# Altium schematic sheet [1]-multipass.SchDoc: ENTER SHEET TITLE
size B; Engineer: ENTER ENGINEER NAME; Organization: CUAir; Address1: L3, 12a Rodborough Rd; Address2: Frenchs Forest; Address3: NSW; Address4: Australia 2086; Revision: ENTER REVISION NUMBER; CompetitionYear: 2019; CPN: ENTER CPN; PROJECT: ENTER PROJECT NAME
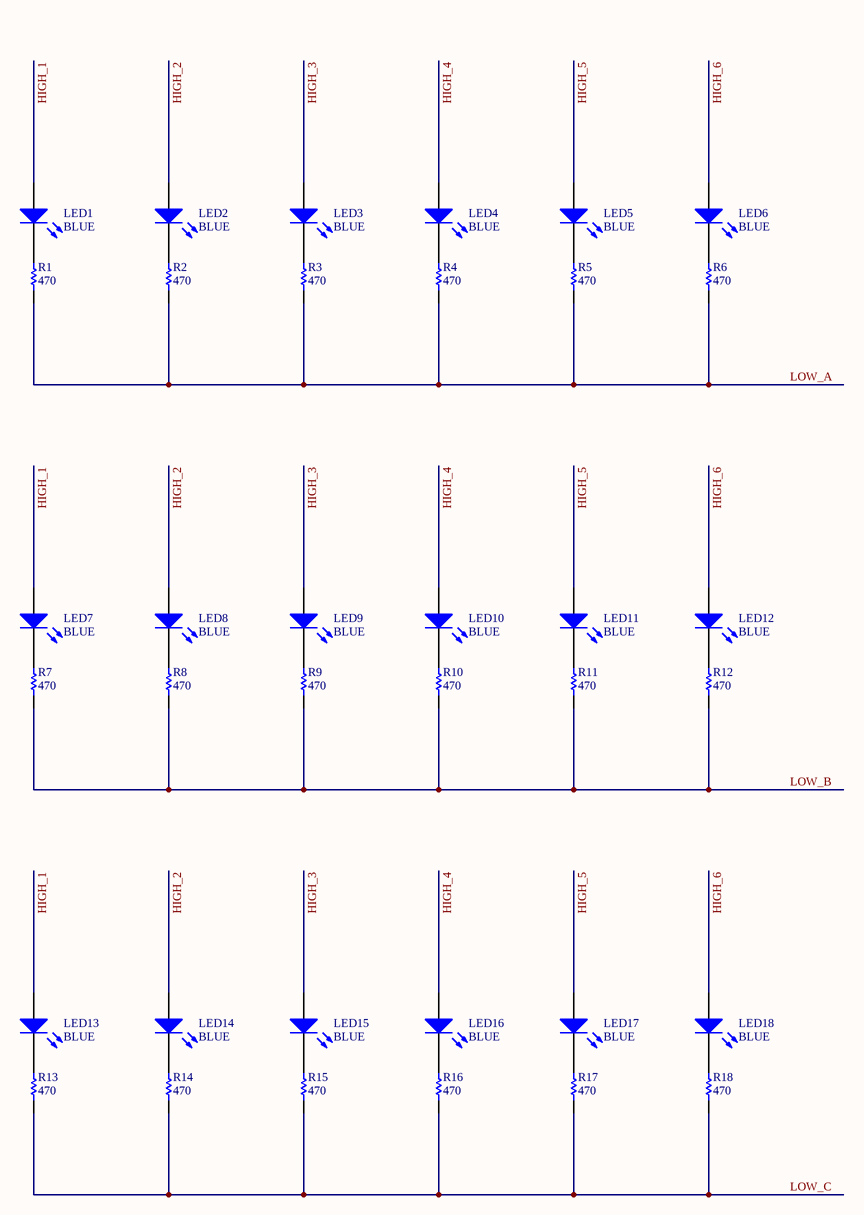
[diagram p0: [1]-multipass.SchDoc]

## Parts
LED1  value BLUE  [0603_A]  (hidden comment: 150060BS75000)
LED2  value BLUE  [0603_A]  (hidden comment: 150060BS75000)
LED3  value BLUE  [0603_A]  (hidden comment: 150060BS75000)
LED4  value BLUE  [0603_A]  (hidden comment: 150060BS75000)
LED5  value BLUE  [0603_A]  (hidden comment: 150060BS75000)
LED6  value BLUE  [0603_A]  (hidden comment: 150060BS75000)
LED7  value BLUE  [0603_A]  (hidden comment: 150060BS75000)
LED8  value BLUE  [0603_A]  (hidden comment: 150060BS75000)
LED9  value BLUE  [0603_A]  (hidden comment: 150060BS75000)
LED10  value BLUE  [0603_A]  (hidden comment: 150060BS75000)
LED11  value BLUE  [0603_A]  (hidden comment: 150060BS75000)
LED12  value BLUE  [0603_A]  (hidden comment: 150060BS75000)
LED13  value BLUE  [0603_A]  (hidden comment: 150060BS75000)
LED14  value BLUE  [0603_A]  (hidden comment: 150060BS75000)
LED15  value BLUE  [0603_A]  (hidden comment: 150060BS75000)
LED16  value BLUE  [0603_A]  (hidden comment: 150060BS75000)
LED17  value BLUE  [0603_A]  (hidden comment: 150060BS75000)
LED18  value BLUE  [0603_A]  (hidden comment: 150060BS75000)
R1  470  [RESC0402(1005)_L]
R2  470  [RESC0402(1005)_L]
R3  470  [RESC0402(1005)_L]
R4  470  [RESC0402(1005)_L]
R5  470  [RESC0402(1005)_L]
R6  470  [RESC0402(1005)_L]
R7  470  [RESC0402(1005)_L]
R8  470  [RESC0402(1005)_L]
R9  470  [RESC0402(1005)_L]
R10  470  [RESC0402(1005)_L]
R11  470  [RESC0402(1005)_L]
R12  470  [RESC0402(1005)_L]
R13  470  [RESC0402(1005)_L]
R14  470  [RESC0402(1005)_L]
R15  470  [RESC0402(1005)_L]
R16  470  [RESC0402(1005)_L]
R17  470  [RESC0402(1005)_L]
R18  470  [RESC0402(1005)_L]

## Nets
HIGH_1: LED1.2(A) LED7.2(A) LED13.2(A)
HIGH_2: LED2.2(A) LED8.2(A) LED14.2(A)
HIGH_3: LED3.2(A) LED9.2(A) LED15.2(A)
HIGH_4: LED4.2(A) LED10.2(A) LED16.2(A)
HIGH_5: LED5.2(A) LED11.2(A) LED17.2(A)
HIGH_6: LED6.2(A) LED12.2(A) LED18.2(A)
LOW_A: R1.1 R2.1 R3.1 R4.1 R5.1 R6.1
LOW_B: R7.1 R8.1 R9.1 R10.1 R11.1 R12.1
LOW_C: R13.1 R14.1 R15.1 R16.1 R17.1 R18.1
NetLED1_1: LED1.1(K) R1.2
NetLED2_1: LED2.1(K) R2.2
NetLED3_1: LED3.1(K) R3.2
NetLED4_1: LED4.1(K) R4.2
NetLED5_1: LED5.1(K) R5.2
NetLED6_1: LED6.1(K) R6.2
NetLED7_1: LED7.1(K) R7.2
NetLED8_1: LED8.1(K) R8.2
NetLED9_1: LED9.1(K) R9.2
NetLED10_1: LED10.1(K) R10.2
NetLED11_1: LED11.1(K) R11.2
NetLED12_1: LED12.1(K) R12.2
NetLED13_1: LED13.1(K) R13.2
NetLED14_1: LED14.1(K) R14.2
NetLED15_1: LED15.1(K) R15.2
NetLED16_1: LED16.1(K) R16.2
NetLED17_1: LED17.1(K) R17.2
NetLED18_1: LED18.1(K) R18.2

## Notes on the sheet
- Project
- Title
- Size:
- Date:
- B
- Number:
- Revision:
- File:

## Library data of the parts
LED1-LED18 = CMP-1426-00002-1: SMD mono-color Chip LED, WL-SMCW, Green; Manufacturer: Wuerth Elektronik; MPN: 150060GS75000; ComponentLink1URL: http://www.we-online.com; ComponentLink2Description: Datasheet; ComponentLink2URL: http://katalog.we-online.com/led/datasheet/150060GS75000.pdf; ComponentLink1Description: Manufacturer URL
R1-R18 = CMP-1011-00473-1: 10K 0.063W 1% 0402 (1005 Metric)  SMD; MPN: RC0402JR-07470RL; Manufacturer: Yageo; Value: 470